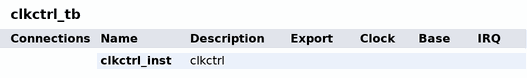
[diagram p0: system contents]
# Platform Designer (Qsys) system clkctrl_tb, Cyclone 10 LP 10CL006YE144A7G
# Parameters at their usual value, and those the tool derives, are not listed.
package require qsys
create_system clkctrl_tb
set_project_property DEVICE_FAMILY {Cyclone 10 LP}
set_project_property DEVICE 10CL006YE144A7G

add_instance clkctrl_inst clkctrl 1.0

set_interconnect_requirement {$system} qsys_mm.clockCrossingAdapter HANDSHAKE
set_interconnect_requirement {$system} qsys_mm.enableEccProtection FALSE
set_interconnect_requirement {$system} qsys_mm.insertDefaultSlave FALSE
set_interconnect_requirement {$system} qsys_mm.maxAdditionalLatency 1

save_system clkctrl_tb.qsys
